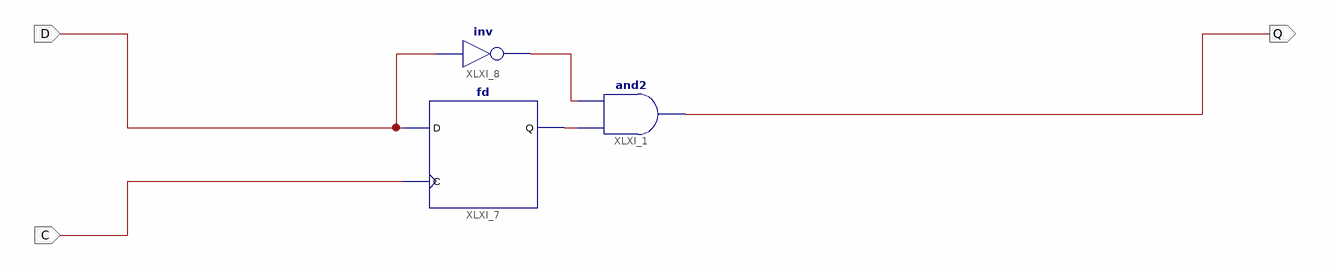
[diagram p0: schematic sheet 1]
// Xilinx ISE schematic FallingEdge.sch (artix7) as structural Verilog: 3 symbols, 3 ports
module FallingEdge (
  input  D,
  input  C,
  output Q
);

  wire XLXN_9, XLXN_10;

  and XLXI_1 (Q, XLXN_9, XLXN_10);
  fd XLXI_7 (.C(C), .D(D), .Q(XLXN_9));
  not XLXI_8 (XLXN_10, D);
endmodule
